# Altium schematic sheet encoderBreakout1.SchDoc
size 254 x 152 mm
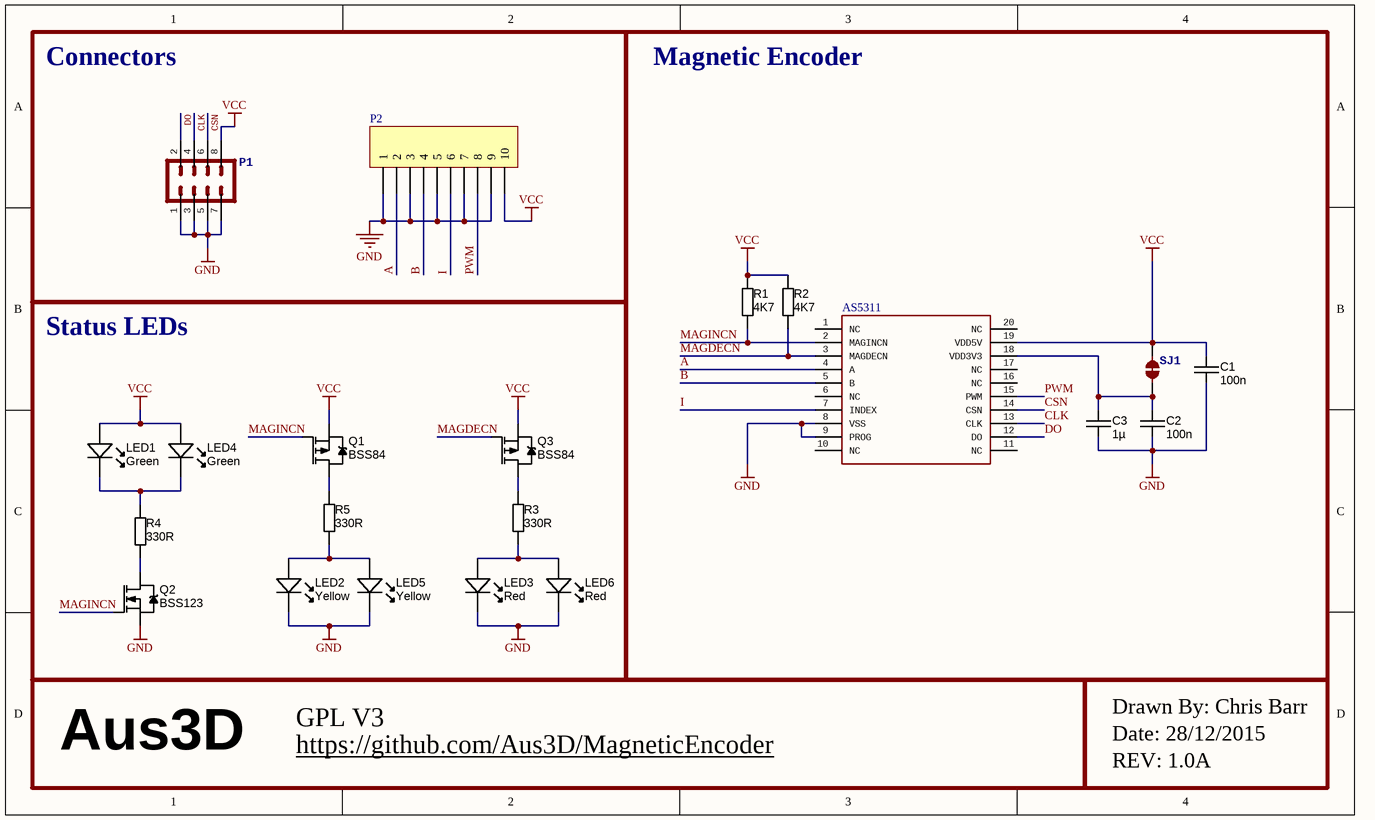
[diagram p0: encoderBreakout1.SchDoc]

## Parts
Aus3D  Aus3D  [Aus3D-Logo]  (value not drawn)
C1  value 100n  [CAPC1608X90N]  (hidden comment: approved sub OK)
C2  value 100n  [CAPC1608X90N]  (hidden comment: approved sub OK)
C3  value 1µ  [CAPC1608X90N]  (hidden comment: approved sub OK)
LED1  Green  [LED-0603-GREEN]
LED2  Yellow  [LED-0603-YELLOW]
LED3  Red  [LED-0603-RED]
LED4  Green  [LED-0603-GREEN]
LED5  Yellow  [LED-0603-YELLOW]
LED6  Red  [LED-0603-RED]
P1  .1" header, two rows of four.  [2X4]  (value not drawn)
P2  Header 10  [HDR1X10]  (value not drawn)
Q1  BSS84  [SOT23-3]
Q2  BSS123  [SOT23-3]
Q3  BSS84  [SOT23-3]
R1  value 4K7  [RESC1608X55N]  (hidden comment: Thick Film)
R2  value 4K7  [RESC1608X55N]  (hidden comment: Thick Film)
R3  value 330R  [RESC1608X55N]  (hidden comment: Thick Film)
R4  value 330R  [RESC1608X55N]  (hidden comment: Thick Film)
R5  value 330R  [RESC1608X55N]  (hidden comment: Thick Film)
SJ1  JUMPER-PAD-2-NC_BY_TRACE  [PAD-JUMPER-2-NC_BY_TRACE_YES_SILK]  (value not drawn)
U1  AS5311  [TSSOP-20]

## Blocks framed on the sheet
Connectors: P1 P2
Magnetic Encoder: C1-C3 R1 R2 SJ1 U1
Status LEDs: LED1-LED6 Q1-Q3 R3-R5

## Nets
GND: C1.2 C2.2 C3.2 LED2.K LED3.K LED5.K LED6.K P1.1 P1.3 P1.5 P1.7 P2.1 P2.3 P2.5 P2.7 P2.9 Q2.2(S) U1.8(VSS) U1.9(PROG)
VCC: C1.1 LED1.A LED4.A P1.8 P2.10 Q1.2(S) Q3.2(S) R1.1 R2.1 SJ1.2 U1.19(VDD5V)
A: P2.2 U1.4(A)
B: P2.4 U1.5(B)
CLK: P1.4 U1.13(CLK)
CSN: P1.6 U1.14(CSN)
DO: P1.2 U1.12(DO)
I: P2.6 U1.7(INDEX)
MAGDECN: Q3.1(G) R2.2 U1.3(MAGDECN)
MAGINCN: Q1.1(G) Q2.1(G) R1.2 U1.2(MAGINCN)
PWM: P2.8 U1.15(PWM)
NetC2_1: C2.1 C3.1 SJ1.1 U1.18(VDD3V3)
NetLED1_K: LED1.K LED4.K R4.1
NetLED2_A: LED2.A LED5.A R5.2
NetLED3_A: LED3.A LED6.A R3.2
NetQ1_3: Q1.3(D) R5.1
NetQ2_3: Q2.3(D) R4.2
NetQ3_3: Q3.3(D) R3.1

Not connected (* = marked no-connect by the designer): U1 1(NC) 6(NC) 10(NC) 11(NC) 16(NC) 17(NC) 20(NC)

## Notes on the sheet
- https://github.com/Aus3D/MagneticEncoder
- GPL V3
- Drawn By: Chris Barr
- Date: 28/12/2015
- REV: 1.0A

## Library data of the parts
Aus3D = Aus3D Logo
C1 C2 = CAPC_100n_0603_X7R_50V_10%: Capacitor SMD Cer 100nF 10% 50V X7R 0603; Manufacturer 1: AVX Corporation; Manufacturer Part Number 1: 06035C104KAT2A; Ratings: 50V; X7R; Material: ceramic; SCDType: spec; Manufacturer 2: TDK Corporation; Manufacturer Part Number 2: C1608X7R1H104K; Package / Case: 0603 (1608 Metric); Tolerance: ±10%; Supplier 1: Digi-Key; Supplier Part Number 1: 478-5052-1-ND; ComponentLink1URL: http://www.avx.com/docs/Catalogs/cx7r.pdf; ComponentLink1Description: http://www.avx.com/docs/Catalogs/cx7r.pdf; Supplier 2: Digi-Key; Supplier Part Number 2: 445-1314-1-ND; ComponentLink2URL: http://product.tdk.com/capacitor/mlcc/en/documents/mlcc_commercial_general_en.pdf; ComponentLink2Description: http://product.tdk.com/capacitor/mlcc/en/documents/mlcc_commercial_general_en.pdf
C3 = CAPC_1u_0603_X7R_16V_10%: Capacitor SMD Cer 1uF 10% 16V X7R 0603; Manufacturer 1: TDK Corporation; Manufacturer Part Number 1: C1608X7R1C105K; Ratings: 16V; X7R; Material: ceramic; SCDType: spec; Package / Case: 0603 (1608 metric); Tolerance: ±10%; Supplier 1: Digi-Key; Supplier Part Number 1: 445-1604-1-ND; ComponentLink1URL: http://product.tdk.com/capacitor/mlcc/en/documents/mlcc_commercial_general_en.pdf; ComponentLink1Description: http://product.tdk.com/capacitor/mlcc/en/documents/mlcc_commercial_general_en.pdf
LED1 LED4 = LED_SMD_Green_0603_570nm: LED 0603 SMD Green 570nm 50mcd 20mA; Manufacturer 1: Kingbright Company LLC; Manufacturer Part Number 1: APT1608CGCK; Material: AlGaInP; Ratings: 20mcd min; 50 mcd typ; 570 nm; Voltage - Forward (Vf) Typ: 2.1V; Viewing Angle: 120°; Lens Style/Size: Rectangle with Flat Top, 1.1mm x 0.8mm; Voltage - Forward (Vf) @ 10mA: 2.0V; SCDType: source; Wavelength - Peak: 574nm; Lens Type: Clear; Package / Case: 0603 (1608 metric); Color: Green; Current - Test: 20mA; Supplier 1: Digi-Key; Supplier Part Number 1: 754-1116-1-ND; RoHS 1: RoHS Compliant; Wavelength - Dominant: 570nm; ComponentLink1URL: http://www.us.kingbright.com/images/catalog/SPEC/APT1608CGCK.pdf; ComponentLink1Description: http://www.us.kingbright.com/images/catalog/SPEC/APT1608CGCK.pdf
LED2 LED5 = LED_SMD_Yellow_0603_150mcd: LED 0603 SMD Yellow 590nm 150mcd 20mA; Manufacturer 1: Kingbright Company LLC; Manufacturer Part Number 1: APT1608SYCK; Material: AlGaInP on GaAs; Ratings: 150 mcd; 590 nm; Voltage - Forward (Vf) Typ: 2V; Voltage - Forward (Vf) @ 10mA: 1.95V; SCDType: source; Package / Case: 0603 (1608 metric); Supplier 1: Digi-Key; Supplier Part Number 1: 754-1124-1-ND; ComponentLink1URL: http://www.us.kingbright.com/images/catalog/SPEC/APT1608SYCK.pdf; ComponentLink1Description: http://www.us.kingbright.com/images/catalog/SPEC/APT1608SYCK.pdf
LED3 LED6 = LED_SMD_Red_0603_220mcd: LED 0603 SMD Hyper Red 630nm 220mcd 20mA; Manufacturer 1: Kingbright Company LLC; Manufacturer Part Number 1: APT1608SURCK; Material: AlGaInP on GaAs; Ratings: 220 mcd; 630 nm; Voltage - Forward (Vf) Typ: 1.95V; Voltage - Forward (Vf) @ 10mA: 1.9V; SCDType: source; Package / Case: 0603 (1608 metric); Supplier 1: Digi-Key; Supplier Part Number 1: 754-1123-1-ND; ComponentLink1URL: http://www.us.kingbright.com/images/catalog/SPEC/APT1608SURCK.pdf; ComponentLink1Description: http://www.us.kingbright.com/images/catalog/SPEC/APT1608SURCK.pdf
P1 = M04X2
P2 = Header 10: Header, 10-Pin; LatestRevisionDate: 17-Jul-2002; LatestRevisionNote: Re-released for DXP Platform.; Publisher: Altium Limited
Q1 Q3 = MOSFET_BSS84: MOSFET SMD P-CH 50V 130mA SOT23-3; Manufacturer 1: Fairchild Semiconductor; Ratings: 50V; 130mA; Material: Metal Oxide; FET Type: MOSFET P-Channel, Metal Oxide; FET Feature: Logic Level Gate; Rds On (Max) @ Id, Vgs: 10 Ohm @ 100mA, 5V; Vgs(th) (Max) @ Id: 2V @ 1mA; Gate Charge (Qg) @ Vgs: 1.3nC @ 5V; Input Capacitance (Ciss) @ Vds: 73pF @ 25V; Power - Max: 360mW; SCDType: undef; Package / Case: SOT23-3; Supplier 1: Digi-Key; Supplier Part Number 1: BSS84CT-ND; Manufacturer Part Number 1: BSS84; Drain to Source Voltage (Vdss): 50V; Current - Continuous Drain (Id) @ 25° C: 130mA; Supplier Device Package: SOT-23; ComponentLink1URL: http://www.fairchildsemi.com/ds/BS/BSS84.pdf; ComponentLink1Description: http://www.fairchildsemi.com/ds/BS/BSS84.pdf
Q2 = MOSFET_BSS123: MOSFET SMD N-CH 100V 170mA SOT23-3; Manufacturer 1: Diodes Inc; Manufacturer Part Number 1: BSS123-7-F; Ratings: 100V; 170mA; Material: Metal Oxide; SCDType: source; Package / Case: SOT23-3; Supplier 1: Digi-Key; Supplier Part Number 1: BSS123-FDICT-ND
R1 R2 = RES_4K7_0603_5%: Resistor SMD chip 4.7k Ohm 0.1W 5% 0603; Manufacturer 1: Vishay/Dale; Manufacturer Part Number 1: CRCW06034K70JNEA; Ratings: 1/10 W; SCDType: spec; Package / Case: 0603 (1608 metric); Tolerance: ±5%; Material: Thick Film; Supplier 1: Digi-Key; Supplier Part Number 1: 541-4.7KGCT-ND
R3-R5 = RES_330R_0603_5%: Resistor SMD chip 330 Ohm 0.1W 5% 0603; Manufacturer 1: Vishay Dale; Manufacturer Part Number 1: CRCW0603330RJNEA; Ratings: 1/10 W; SCDType: spec; Manufacturer 2: Yageo; Manufacturer Part Number 2: RC0603JR-07330RL; Package / Case: 0603 (1608 metric); Tolerance: ±5%; Material: Thick Film; Supplier 1: Digi-Key; Supplier Part Number 1: 541-330GCT-ND; ComponentLink1URL: http://www.vishay.com/doc?20035; ComponentLink1Description: http://www.vishay.com/doc?20035; Supplier 2: Digi-Key; Supplier Part Number 2: 311-330GRCT-ND; ComponentLink2URL: http://www.yageo.com/documents/recent/PYu-RC0603_51_RoHS_L_4.pdf; ComponentLink2Description: http://www.yageo.com/documents/recent/PYu-RC0603_51_RoHS_L_4.pdf
U1 = AS5311: AMS's AS5311 linear hall-effect encoder.